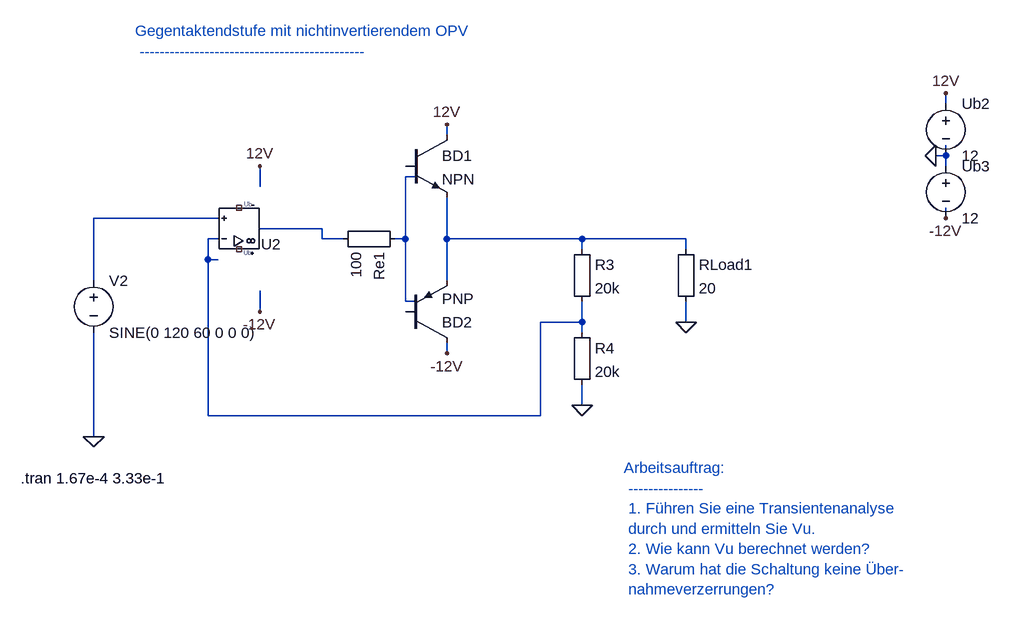
[diagram p0: schematic 9_2_4_1_Gegentaktendstufe_mit_OPV.asc]
9_2_4_1_Gegentaktendstufe_mit_OPV.asc, the LTspice schematic file:
Version 4
SHEET 1 880 680
WIRE 1488 240 1488 224
WIRE 656 256 672 256
WIRE 672 256 672 272
WIRE 720 304 720 336
WIRE 176 512 176 528
WIRE 1488 336 1488 320
WIRE 656 480 672 480
WIRE 672 480 672 464
WIRE 720 432 720 400
WIRE 368 368 352 368
WIRE 352 368 352 400
WIRE 352 400 368 400
WIRE 432 352 528 352
WIRE 528 352 528 368
WIRE 1472 240 1488 240
WIRE 1488 160 1488 144
WIRE 176 672 176 528
WIRE 1088 496 1088 464
WIRE 1488 256 1488 240
WIRE 720 208 720 192
WIRE 640 368 656 368
WIRE 1088 384 1088 368
WIRE 1088 368 928 368
WIRE 720 544 720 528
WIRE 720 368 720 336
WIRE 720 400 720 368
WIRE 656 368 656 272
WIRE 656 272 672 272
WIRE 672 464 656 464
WIRE 656 464 656 368
WIRE 528 368 560 368
WIRE 928 512 928 496
WIRE 928 368 720 368
WIRE 928 384 928 368
WIRE 928 592 928 624
WIRE 928 496 928 464
WIRE 352 400 352 640
WIRE 352 640 864 640
WIRE 864 640 864 496
WIRE 864 496 928 496
WIRE 176 432 176 336
WIRE 176 336 368 336
WIRE 432 288 432 256
WIRE 432 480 432 448
FLAG 1472 240 0
FLAG 176 672 0
FLAG 1088 496 0
FLAG 928 624 0
FLAG 1472 240 0
FLAG 176 672 0
FLAG 1088 496 0
FLAG 928 624 0
FLAG 1488 144 12V
FLAG 720 192 12V
FLAG 432 256 12V
FLAG 1488 336 -12V
FLAG 720 544 -12V
FLAG 432 480 -12V
SYMBOL voltage 1488 144 R0
SYMATTR InstName Ub2
SYMATTR Value 12
SYMBOL npn 656 208 R0
SYMATTR InstName BD1
SYMATTR Value NPN
SYMBOL Misc\EuropeanResistor 656 352 R90
SYMATTR InstName Re1
SYMATTR Value 100
SYMBOL voltage 176 416 R0
SYMATTR InstName V2
SYMATTR Value SINE(0 120 60 0 0 0)
SYMBOL Misc\EuropeanResistor 1072 368 R0
SYMATTR InstName RLoad1
SYMATTR Value 20
SYMBOL voltage 1488 240 R0
SYMATTR InstName Ub3
SYMATTR Value 12
SYMBOL pnp 656 528 M180
SYMATTR InstName BD2
SYMATTR Value PNP
SYMBOL UniversalOpAmp2 400 352 M180
SYMATTR InstName U2
SYMATTR Value UniversalOpAmp2
SYMBOL Misc\EuropeanResistor 912 368 R0
SYMATTR InstName R3
SYMATTR Value 20k
SYMBOL Misc\EuropeanResistor 912 496 R0
SYMATTR InstName R4
SYMATTR Value 20k
TEXT 64 736 Left 2 !.tran 1.67e-4 3.33e-1
TEXT 240 48 Left 2 ;Gegentaktendstufe mit nichtinvertierendem OPV \n ---------------------------------------------
TEXT 992 720 Left 2 ;Arbeitsauftrag: \n --------------- \n 1. Führen Sie eine Transientenanalyse \n durch und ermitteln Sie Vu. \n 2. Wie kann Vu berechnet werden? \n 3. Warum hat die Schaltung keine Über- \n nahmeverzerrungen?

The netlist it stands for:
* 9_2_4_1_Gegentaktendstufe_mit_OPV.asc
V§Ub2 12V 0 12
Q§BD1 12V N001 N002 0 NPN
Re1 N001 N004 100
V2 N005 0 SINE(0 120 60 0 0 0)
RLoad1 N002 0 20
V§Ub3 0 -12V 12
Q§BD2 -12V N001 N002 0 PNP
XU2 N005 N003 NC_01 NC_02 N004 level2 UniversalOpAmp2 Avol=1Meg GBW=10Meg Slew=10Meg Ilimit=25m Rail=0 Vos=0 En=0 Enk=0 In=0 Ink=0 Rin=500Meg  ; pins In+ In- V+ V- OUT
R3 N002 N003 20k
R4 N003 0 20k
.model NPN NPN
.model PNP PNP
.lib standard.bjt
.tran 1.67e-4 3.33e-1
* Gegentaktendstufe mit nichtinvertierendem OPV
*  ---------------------------------------------
* Arbeitsauftrag:
*  ---------------
*  1. Führen Sie eine Transientenanalyse
*  durch und ermitteln Sie Vu.
*  2. Wie kann Vu berechnet werden?
*  3. Warum hat die Schaltung keine Über-
*  nahmeverzerrungen?
.lib UniversalOpAmp2.lib
.backanno
.end